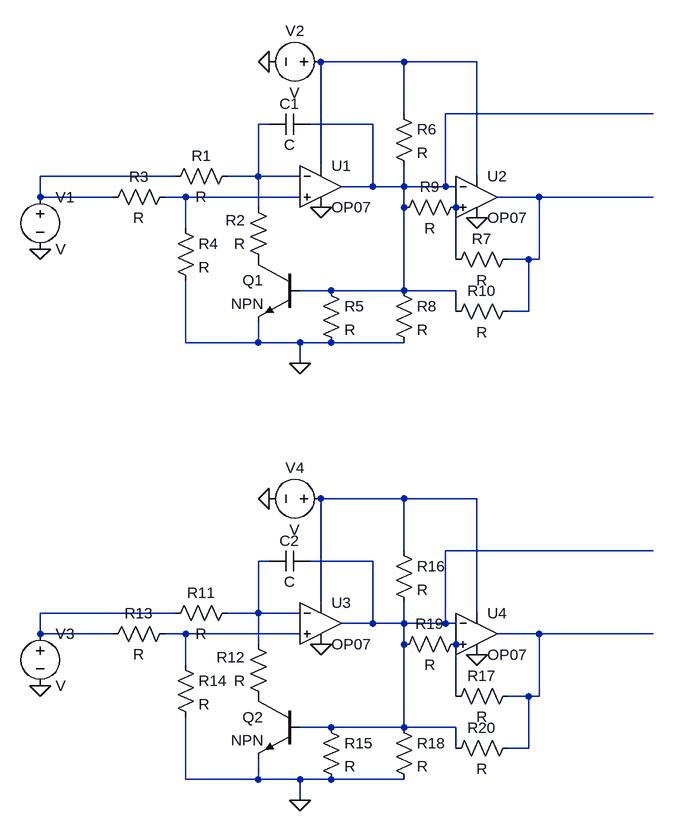
[diagram p0: schematic dual untuned audio TRIANGLE and SQUARE vco.asc]
dual untuned audio TRIANGLE and SQUARE vco.asc, the LTspice schematic file:
Version 4.1
SHEET 1 880 1076
WIRE 288 -80 160 -80
WIRE 400 -80 288 -80
WIRE 288 0 288 -80
WIRE 672 0 352 0
WIRE 80 16 64 16
WIRE 240 16 144 16
WIRE 160 80 160 -80
WIRE -64 96 -272 96
WIRE 64 96 64 16
WIRE 64 96 16 96
WIRE 128 96 64 96
WIRE 400 96 400 -80
WIRE 240 112 240 16
WIRE 240 112 192 112
WIRE 288 112 288 80
WIRE 288 112 240 112
WIRE 352 112 352 0
WIRE 352 112 288 112
WIRE 368 112 352 112
WIRE -272 128 -272 96
WIRE -160 128 -272 128
WIRE -48 128 -80 128
WIRE 128 128 -48 128
WIRE 496 128 432 128
WIRE 672 128 496 128
WIRE 64 144 64 96
WIRE 288 144 288 112
WIRE -48 176 -48 128
WIRE 368 224 368 144
WIRE 480 224 448 224
WIRE 496 224 496 128
WIRE 496 224 480 224
WIRE 176 272 128 272
WIRE 288 272 288 144
WIRE 288 272 176 272
WIRE 368 272 288 272
WIRE 368 304 368 272
WIRE 480 304 480 224
WIRE 480 304 448 304
WIRE -48 352 -48 256
WIRE 64 352 64 320
WIRE 64 352 -48 352
WIRE 128 352 64 352
WIRE 176 352 128 352
WIRE 288 352 176 352
WIRE 128 384 128 352
WIRE 288 592 160 592
WIRE 400 592 288 592
WIRE 288 672 288 592
WIRE 672 672 352 672
WIRE 80 688 64 688
WIRE 240 688 144 688
WIRE 160 752 160 592
WIRE -64 768 -272 768
WIRE 64 768 64 688
WIRE 64 768 16 768
WIRE 128 768 64 768
WIRE 400 768 400 592
WIRE 240 784 240 688
WIRE 240 784 192 784
WIRE 288 784 288 752
WIRE 288 784 240 784
WIRE 352 784 352 672
WIRE 352 784 288 784
WIRE 368 784 352 784
WIRE -272 800 -272 768
WIRE -160 800 -272 800
WIRE -48 800 -80 800
WIRE 128 800 -48 800
WIRE 496 800 432 800
WIRE 672 800 496 800
WIRE 64 816 64 768
WIRE 288 816 288 784
WIRE -48 848 -48 800
WIRE 368 896 368 816
WIRE 480 896 448 896
WIRE 496 896 496 800
WIRE 496 896 480 896
WIRE 176 944 128 944
WIRE 288 944 288 816
WIRE 288 944 176 944
WIRE 368 944 288 944
WIRE 368 976 368 944
WIRE 480 976 480 896
WIRE 480 976 448 976
WIRE -48 1024 -48 928
WIRE 64 1024 64 992
WIRE 64 1024 -48 1024
WIRE 128 1024 64 1024
WIRE 176 1024 128 1024
WIRE 288 1024 176 1024
WIRE 128 1056 128 1024
FLAG -272 208 0
FLAG 80 -80 0
FLAG 128 384 0
FLAG 160 144 0
FLAG 400 160 0
FLAG -272 880 0
FLAG 80 592 0
FLAG 128 1056 0
FLAG 160 816 0
FLAG 400 832 0
SYMBOL OpAmps\\OP07 160 48 R0
SYMATTR InstName U1
SYMBOL OpAmps\\OP07 400 64 R0
SYMATTR InstName U2
SYMBOL res 32 80 R90
WINDOW 0 0 56 VBottom 2
WINDOW 3 32 56 VTop 2
SYMATTR InstName R1
SYMBOL res 80 240 R180
WINDOW 0 36 76 Left 2
WINDOW 3 36 40 Left 2
SYMATTR InstName R2
SYMBOL cap 144 0 R90
WINDOW 0 0 32 VBottom 2
WINDOW 3 32 32 VTop 2
SYMATTR InstName C1
SYMBOL res -64 112 R90
WINDOW 0 0 56 VBottom 2
WINDOW 3 32 56 VTop 2
SYMATTR InstName R3
SYMBOL res -64 160 R0
SYMATTR InstName R4
SYMBOL voltage -272 112 R0
SYMATTR InstName V1
SYMBOL npn 128 224 M0
SYMATTR InstName Q1
SYMBOL res 160 256 R0
SYMATTR InstName R5
SYMBOL res 272 -16 R0
SYMATTR InstName R6
SYMBOL voltage 176 -80 R90
WINDOW 0 -32 56 VBottom 2
WINDOW 3 32 56 VTop 2
SYMATTR InstName V2
SYMBOL res 464 208 R90
WINDOW 0 0 56 VBottom 2
WINDOW 3 32 56 VTop 2
SYMATTR InstName R7
SYMBOL res 272 256 R0
SYMATTR InstName R8
SYMBOL res 384 128 R90
WINDOW 0 0 56 VBottom 2
WINDOW 3 32 56 VTop 2
SYMATTR InstName R9
SYMBOL res 464 288 R90
WINDOW 0 0 56 VBottom 2
WINDOW 3 32 56 VTop 2
SYMATTR InstName R10
SYMBOL OpAmps\\OP07 160 720 R0
SYMATTR InstName U3
SYMBOL OpAmps\\OP07 400 736 R0
SYMATTR InstName U4
SYMBOL res 32 752 R90
WINDOW 0 0 56 VBottom 2
WINDOW 3 32 56 VTop 2
SYMATTR InstName R11
SYMBOL res 80 912 R180
WINDOW 0 36 76 Left 2
WINDOW 3 36 40 Left 2
SYMATTR InstName R12
SYMBOL cap 144 672 R90
WINDOW 0 0 32 VBottom 2
WINDOW 3 32 32 VTop 2
SYMATTR InstName C2
SYMBOL res -64 784 R90
WINDOW 0 0 56 VBottom 2
WINDOW 3 32 56 VTop 2
SYMATTR InstName R13
SYMBOL res -64 832 R0
SYMATTR InstName R14
SYMBOL voltage -272 784 R0
SYMATTR InstName V3
SYMBOL npn 128 896 M0
SYMATTR InstName Q2
SYMBOL res 160 928 R0
SYMATTR InstName R15
SYMBOL res 272 656 R0
SYMATTR InstName R16
SYMBOL voltage 176 592 R90
WINDOW 0 -32 56 VBottom 2
WINDOW 3 32 56 VTop 2
SYMATTR InstName V4
SYMBOL res 464 880 R90
WINDOW 0 0 56 VBottom 2
WINDOW 3 32 56 VTop 2
SYMATTR InstName R17
SYMBOL res 272 928 R0
SYMATTR InstName R18
SYMBOL res 384 800 R90
WINDOW 0 0 56 VBottom 2
WINDOW 3 32 56 VTop 2
SYMATTR InstName R19
SYMBOL res 464 960 R90
WINDOW 0 0 56 VBottom 2
WINDOW 3 32 56 VTop 2
SYMATTR InstName R20

The netlist it stands for:
* dual untuned audio TRIANGLE and SQUARE vco.asc
X§U1 N005 N003 N001 0 N002 LT1001  ; OP07, pins In+ In- V+ V- OUT
X§U2 N007 N002 N001 0 N006 LT1001  ; OP07, pins In+ In- V+ V- OUT
R1 N003 N004 R
R2 P001 N003 R
C1 N002 N003 C
R3 N005 N004 R
R4 N005 0 R
V1 N004 0 V
Q1 P001 N002 0 0 NPN
R5 N002 0 R
R6 N001 N002 R
V2 N001 0 V
R7 N006 N007 R
R8 N002 0 R
R9 N007 N002 R
R10 N006 N002 R
X§U3 N012 N010 N008 0 N009 LT1001  ; OP07, pins In+ In- V+ V- OUT
X§U4 N014 N009 N008 0 N013 LT1001  ; OP07, pins In+ In- V+ V- OUT
R11 N010 N011 R
R12 P002 N010 R
C2 N009 N010 C
R13 N012 N011 R
R14 N012 0 R
V3 N011 0 V
Q2 P002 N009 0 0 NPN
R15 N009 0 R
R16 N008 N009 R
V4 N008 0 V
R17 N013 N014 R
R18 N009 0 R
R19 N014 N009 R
R20 N013 N009 R
.model NPN NPN
.model PNP PNP
.lib standard.bjt
.lib LTC.lib
.backanno
.end